# Altium project Adapter_UNIT_SPI_TO_INTAN.PrjPcb
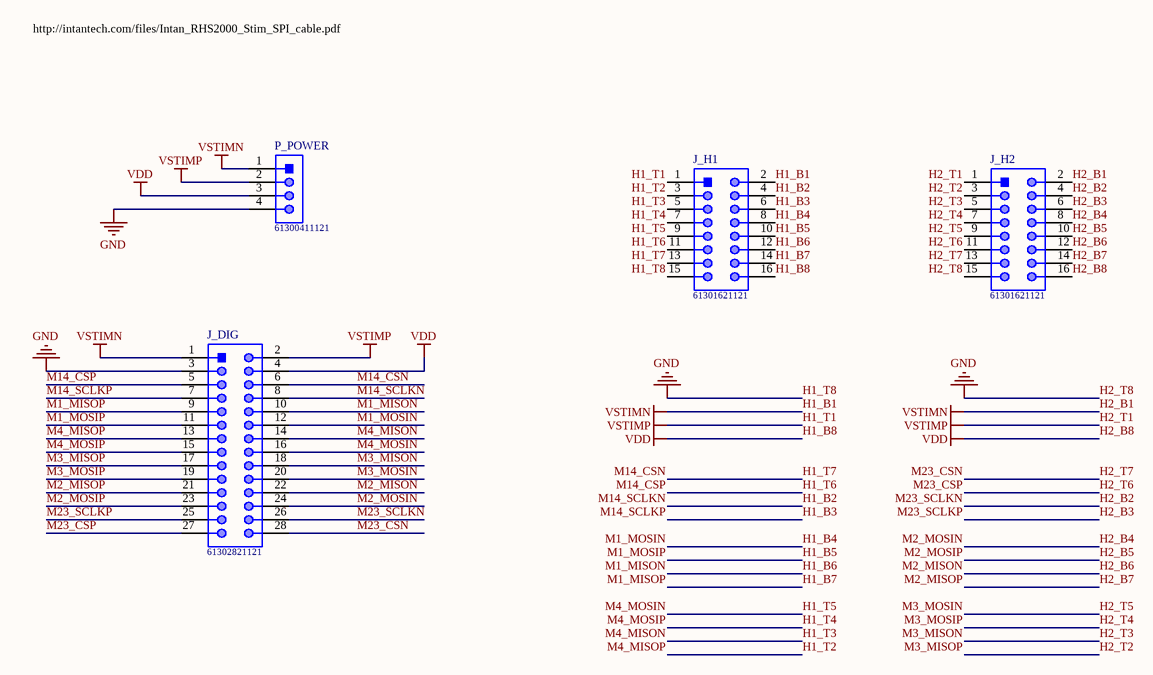
[diagram p0: Adapter_UNIT_SPI_TO_INTAN.SchDoc]
1 sheet, 4 parts. Net scope: hierarchical (ports join the sheet entries above them; power ports are global).
Board file: Adapter_UNIT_SPI_TO_INTAN.PcbDoc

## Sheet Adapter_UNIT_SPI_TO_INTAN.SchDoc
size A4

### Parts
J_DIG  61302821121  [61302821121]
J_H1  61301621121  [61301621121]
J_H2  61301621121  [61301621121]
P_POWER  61300411121  [61300411121]

### Nets
H1_B1: J_DIG.1 J_H1.2 J_H2.2 P_POWER.1  [also labelled H2_B1, VSTIMN]
H1_B8: J_DIG.4 J_H1.16 J_H2.16 P_POWER.3  [also labelled H2_B8, VDD]
H1_T1: J_DIG.2 J_H1.1 J_H2.1 P_POWER.2  [also labelled H2_T1, VSTIMP]
H1_T8: J_DIG.3 J_H1.15 J_H2.15 P_POWER.4  [also labelled GND, H2_T8]
H1_B2: J_DIG.8 J_H1.4  [also labelled M14_SCLKN]
H1_B3: J_DIG.7 J_H1.6  [also labelled M14_SCLKP]
H1_B4: J_DIG.12 J_H1.8  [also labelled M1_MOSIN]
H1_B5: J_DIG.11 J_H1.10  [also labelled M1_MOSIP]
H1_B6: J_DIG.10 J_H1.12  [also labelled M1_MISON]
H1_B7: J_DIG.9 J_H1.14  [also labelled M1_MISOP]
H1_T2: J_DIG.13 J_H1.3  [also labelled M4_MISOP]
H1_T3: J_DIG.14 J_H1.5  [also labelled M4_MISON]
H1_T4: J_DIG.15 J_H1.7  [also labelled M4_MOSIP]
H1_T5: J_DIG.16 J_H1.9  [also labelled M4_MOSIN]
H1_T6: J_DIG.5 J_H1.11  [also labelled M14_CSP]
H1_T7: J_DIG.6 J_H1.13  [also labelled M14_CSN]
H2_B2: J_DIG.26 J_H2.4  [also labelled M23_SCLKN]
H2_B3: J_DIG.25 J_H2.6  [also labelled M23_SCLKP]
H2_B4: J_DIG.24 J_H2.8  [also labelled M2_MOSIN]
H2_B5: J_DIG.23 J_H2.10  [also labelled M2_MOSIP]
H2_B6: J_DIG.22 J_H2.12  [also labelled M2_MISON]
H2_B7: J_DIG.21 J_H2.14  [also labelled M2_MISOP]
H2_T2: J_DIG.17 J_H2.3  [also labelled M3_MISOP]
H2_T3: J_DIG.18 J_H2.5  [also labelled M3_MISON]
H2_T4: J_DIG.19 J_H2.7  [also labelled M3_MOSIP]
H2_T5: J_DIG.20 J_H2.9  [also labelled M3_MOSIN]
H2_T6: J_DIG.27 J_H2.11  [also labelled M23_CSP]
H2_T7: J_DIG.28 J_H2.13  [also labelled M23_CSN]

### Notes on the sheet
- http://intantech.com/files/Intan_RHS2000_Stim_SPI_cable.pdf

### Library data of the parts
J_DIG = CMP-1502-01115-1: THT Vertical Pin Header WR-PHD, Pitch 2.54 mm, Dual Row, 28 pins; Manufacturer: Wurth Elektronik; Pin Number: 28; Contact Resistance: 20mOhm; Withstanding Voltage: 500VAC; Pitch: 2.54mm; Gender: Male; Working Voltage: 250VAC; Rated Current: 3A; Package Reference: 61302821121; Part Number: 61302821121; Mounting Technology: THT; Packaging: Bag; Manufacturer URL: http://www.we-online.de; Row Number: Dual; Orientation: Vertical; Operating Temperature: -40to105degC; Datasheet URL: https://katalog.we-online.de/em/datasheet/6130xx21121.pdf; Publisher: WurthElektronik
J_H1 J_H2 = CMP-1502-01097-1: THT Vertical Pin Header WR-PHD, Pitch 2.54 mm, Dual Row, 16 pins; Manufacturer: Wurth Elektronik; Gender: Male; Rated Current: 3A; Pitch: 2.54mm; Withstanding Voltage: 500VAC; Contact Resistance: 20mOhm; Working Voltage: 250VAC; Pin Number: 16; Mounting Technology: THT; Orientation: Vertical; Manufacturer URL: http://www.we-online.de; Row Number: Dual; Part Number: 61301621121; Datasheet URL: https://katalog.we-online.de/em/datasheet/6130xx21121.pdf; Packaging: Bag; Operating Temperature: -40to105degC; Publisher: WurthElektronik; Package Reference: 61301621121
P_POWER = CMP-1502-01064-1: THT Vertical Pin Header WR-PHD, Pitch 2.54 mm, Single Row, 4 pins; Manufacturer: Wurth Elektronik; Withstanding Voltage: 500VAC; Rated Current: 3A; Working Voltage: 250VAC; Pin Number: 4; Gender: Male; Contact Resistance: 20mOhm; Pitch: 2.54mm; Manufacturer URL: http://www.we-online.de; Operating Temperature: -40to105degC; Packaging: Bag; Mounting Technology: THT; Package Reference: 61300411121; Datasheet URL: https://katalog.we-online.de/em/datasheet/6130xx11121.pdf; Publisher: WurthElektronik; Part Number: 61300411121; Row Number: Single; Orientation: Vertical